# Altium schematic sheet USB_ETH_Mux.SchDoc: STM32 System Board
size 420 x 297 mm; Author: G.Kasprowicz, P. Kulik; CompanyName: WUT ISE; DrawnBy: G.Kasprowicz, P. Kulik; Organization: WUT ISE; DocumentNumber: 4; SheetNumber: 4; ModifiedBy: -; CheckedDate: -; Title2: STM32 CPU; Designer: G.Kasprowicz, P. Kulik; ModifiedDate: -; ProjectName: Sensor Box
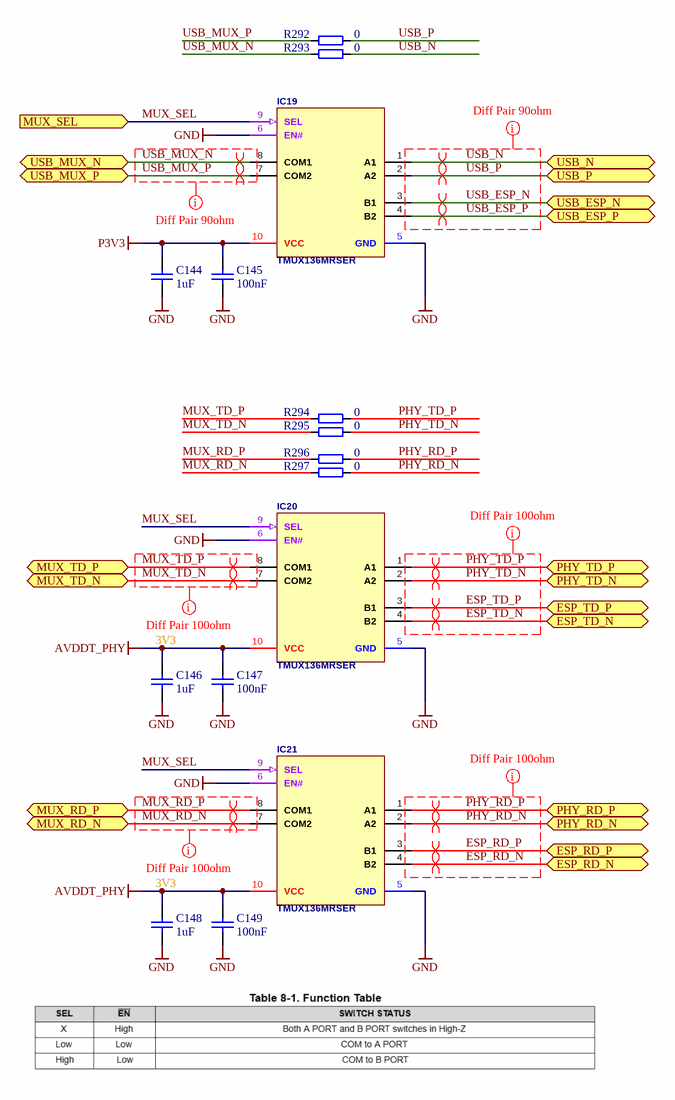
[diagram p0: USB_ETH_Mux.SchDoc]

## Parts
C144  1uF  [CAPC1005X55N]
C145  100nF  [CAPC1005X55N]
C146  1uF  [CAPC1005X55N]
C147  100nF  [CAPC1005X55N]
C148  1uF  [CAPC1005X55N]
C149  100nF  [CAPC1005X55N]
IC19  TMUX136MRSER  [TI_RSE0010A]
IC20  TMUX136MRSER  [TI_RSE0010A]
IC21  TMUX136MRSER  [TI_RSE0010A]
R292  0  [RESC1005X40N]
R293  0  [RESC1005X40N]
R294  0  [RESC1005X40N]
R295  0  [RESC1005X40N]
R296  0  [RESC1005X40N]
R297  0  [RESC1005X40N]

## Ports
ESP_RD_N (bidir), ESP_RD_P (bidir), ESP_TD_N (bidir), ESP_TD_P (bidir), MUX_RD_N (bidir), MUX_RD_P (bidir), MUX_SEL (in), MUX_TD_N (bidir), MUX_TD_P (bidir), PHY_RD_N (bidir), PHY_RD_P (bidir), PHY_TD_N (bidir), PHY_TD_P (bidir), USB_ESP_N (bidir), USB_ESP_P (bidir), USB_MUX_N (bidir), USB_MUX_P (bidir), USB_N (bidir), USB_P (bidir)

## Nets
AVDDT_PHY: C146.2 C147.1 C148.2 C149.1 IC20.10(VCC) IC21.10(VCC)
GND: C144.1 C145.2 C146.1 C147.2 C148.1 C149.2 IC19.5(GND) IC19.6(EN#) IC20.5(GND) IC20.6(EN#) IC21.5(GND) IC21.6(EN#)
P3V3: C144.2 C145.1 IC19.10(VCC)
ESP_RD_N: IC21.4(B2) ; port ESP_RD_N
ESP_RD_P: IC21.3(B1) ; port ESP_RD_P
ESP_TD_N: IC20.4(B2) ; port ESP_TD_N
ESP_TD_P: IC20.3(B1) ; port ESP_TD_P
MUX_RD_N: IC21.7(COM2) R297.1 ; port MUX_RD_N
MUX_RD_P: IC21.8(COM1) R296.1 ; port MUX_RD_P
MUX_SEL: IC19.9(SEL) IC20.9(SEL) IC21.9(SEL) ; port MUX_SEL
MUX_TD_N: IC20.7(COM2) R295.1 ; port MUX_TD_N
MUX_TD_P: IC20.8(COM1) R294.1 ; port MUX_TD_P
PHY_RD_N: IC21.2(A2) R297.2 ; port PHY_RD_N
PHY_RD_P: IC21.1(A1) R296.2 ; port PHY_RD_P
PHY_TD_N: IC20.2(A2) R295.2 ; port PHY_TD_N
PHY_TD_P: IC20.1(A1) R294.2 ; port PHY_TD_P
USB_ESP_N: IC19.3(B1) ; port USB_ESP_N
USB_ESP_P: IC19.4(B2) ; port USB_ESP_P
USB_MUX_N: IC19.8(COM1) R293.1 ; port USB_MUX_N
USB_MUX_P: IC19.7(COM2) R292.1 ; port USB_MUX_P
USB_N: IC19.1(A1) R293.2 ; port USB_N
USB_P: IC19.2(A2) R292.2 ; port USB_P

## Layout directives
mark named Diff Pair 90ohm: USB_ESP_N, USB_ESP_P, USB_MUX_N, USB_MUX_P, USB_N, USB_P
differential pair: ESP_RD_N, ESP_RD_P, ESP_TD_N, ESP_TD_P, MUX_RD_N, MUX_RD_P, MUX_TD_N, MUX_TD_P, PHY_RD_N, PHY_RD_P, PHY_TD_N, PHY_TD_P, USB_ESP_N, USB_ESP_P, USB_MUX_N, USB_MUX_P, USB_N, USB_P
mark named Diff Pair 100ohm: ESP_RD_N, ESP_RD_P, ESP_TD_N, ESP_TD_P, MUX_RD_N, MUX_RD_P, MUX_TD_N, MUX_TD_P, PHY_RD_N, PHY_RD_P, PHY_TD_N, PHY_TD_P

## Notes on the sheet
- (near C146) 3V3
- (near C148) 3V3
- Project/Equipment
- Document
- Designer
- Drawn by
- Check.by
- Copyright WUT =Copy(CurrentDate,7,4)
  This document describes Open Hardware and is licensed under the CERN-OHL-W v2
  You may redistribute and modify this documentation and make products using it under the terms of the CERN-OHL-W v2 (https:/cern.ch/cern-ohl). This documentation is distributed WITHOUT ANY EXPRESS OR IMPLIED WARRANTY, INCLUDING OF MERCHANTABILITY, SATISFACTORY QUALITY AND FITNESS FOR A PARTICULAR PURPOSE. Please see the CERN-OHL-W v2 for applicable conditions.
  Source location: =SourceLocation
  As per CERN-OHL-W v2 section 4, should You produce hardware based on these sources, You must maintain the Source Location visible on the silkscreen or top copper for a =Title1 PCB or other product you make using this documentation.
- Contact:
- File
- Last Mod.
- Print Date
- Sheet
- Size
- A3
- of
- Rev

## Library data of the parts
C144 C146 C148 = CC0402_1UF_16V_10%_X5R: Non-polarised capacitor; Part Description: SMD Multilayer Chip Ceramic Capacitor; Manufacturer: GENERIC; Manufacturer1 Part Number: C1005X5R1C105KT; Voltage: 16V; TC: X5R; Tolerance: ±10%; Part Number: CC0402_1UF_16V_10%_X5R; Component Kind: Standard; Component Type: Standard; Pin Count: 2; Value: 1uF; Status: Preferred; Manufacturer Part Number: CC0402_1UF_16V_10%_X5R; Case: 0402; Mounted: Yes; Socket: No; SMD: Yes; Sense: No; Manufacturer1 Example: TDK; Manufacturer1 ComponentHeight: 0.55mm; HelpURL: \\cern.ch\dfs\Applications\Altium\Datasheets\CC0402_X5R_TDK_C.pdf; Author: CERN DEM JLC; CreateDate: 2012-10-25; LatestRevisionDate: 2012-10-25
C145 C147 C149 = CC0402_100NF_16V_10%_X5R: Non-polarised capacitor; Part Description: SMD Multilayer Chip Ceramic Capacitor; Manufacturer: GENERIC; Manufacturer1 Part Number: GRM155R61C104KA88D; Voltage: 16V; TC: X5R; Tolerance: ±10%; Value: 100nF; Part Number: CC0402_100NF_16V_10%_X5R; Component Kind: Standard; Component Type: Standard; Pin Count: 2; Status: None; Manufacturer Part Number: CC0402_100NF_16V_10%_X5R; Case: 0402; Mounted: Yes; Socket: No; SMD: Yes; Sense: No; Manufacturer1 Example: MURATA; Manufacturer1 ComponentHeight: 0.55mm; HelpURL: \\cern.ch\dfs\Applications\Altium\Datasheets\CC0402_X5R_MURATA_GRM.pdf; Author: CERN DEM JLC; CreateDate: 10/12/2013; LatestRevisionDate: 10/12/2013
IC19-IC21 = TMUX136: Two-Channel Differential 2:1 MUX or 1:2 Demux; Manufacturer: Texas Instruments; Manufacturer Part Number: TMUX136MRSER
R292-R297 = R0402_0R_JUMPER: Resistor; Part Description: 1A (0.05R Max DC Resistance) Zero Ohm Jumper; Manufacturer: GENERIC; Manufacturer1 Part Number: 232270591001L; PressFit: No; Part Number: R0402_0R_JUMPER; Component Kind: Standard; Component Type: Standard; Pin Count: 2; Value: 0; Status: Not Recommended; Manufacturer Part Number: R0402_0R_JUMPER; Case: 0402; Mounted: Yes; Sense: No; Socket: No; SMD: Yes; Manufacturer1 Example: YAGEO PHYCOMP; Manufacturer1 ComponentHeight: 0.4mm; HelpURL: \\cern.ch\dfs\Applications\Altium\Datasheets\R0402_Phycomp_RC0402.pdf; Author: CERN DEM JLC; CreateDate: 03/12/2007; LatestRevisionDate: 17/10/2012